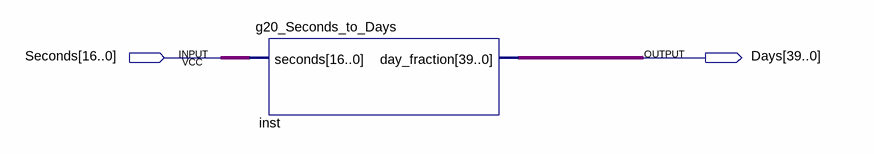
[diagram p0: schematic sheet]
// Quartus schematic g20_seconds-to-day-fraction circuit.bdf as structural Verilog: 1 symbols, 2 pins
module \g20_seconds-to-day-fraction_circuit  (
  input  [16:0] Seconds,
  output [39:0] Days
);

  g20_Seconds_to_Days inst (.seconds(Seconds), .day_fraction(Days));
endmodule
